# Altium schematic sheet power_supply.SchDoc
size A3
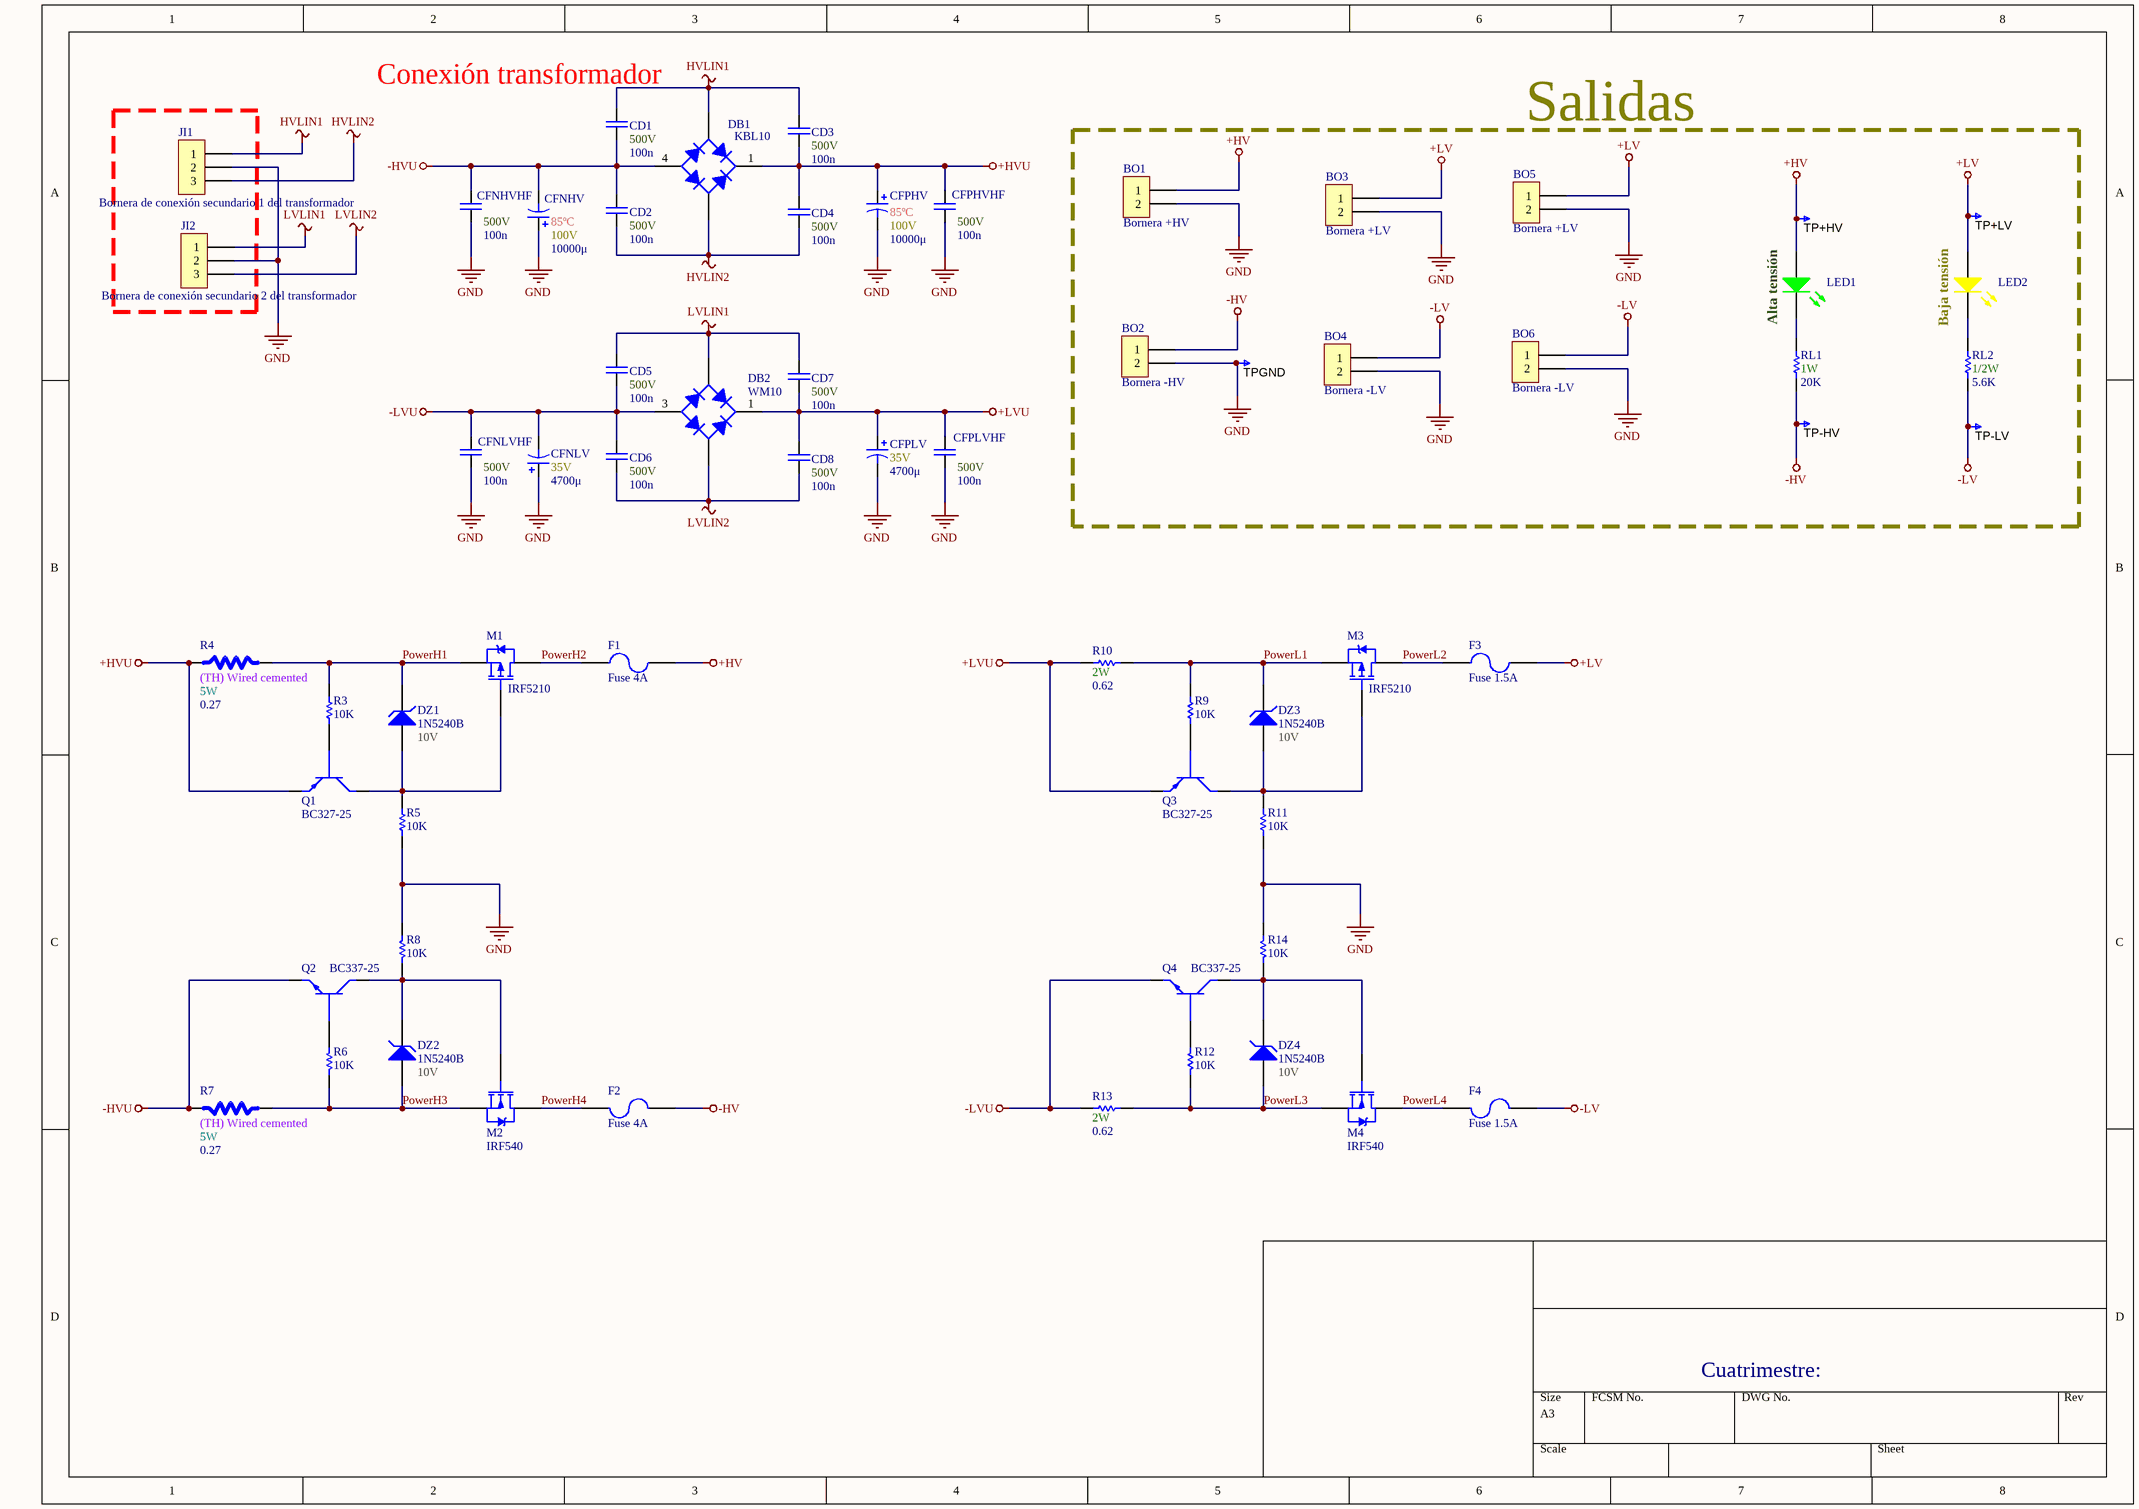
[diagram p0: power_supply.SchDoc]

## Parts
BO1  Bornera +HV  [TE-C-282822-2-C-PLUGGED]
BO2  Bornera -HV  [TE-C-282822-2-C-PLUGGED]
BO3  Bornera +LV  [TE-C-282822-2-C-PLUGGED]
BO4  Bornera -LV  [TE-C-282822-2-C-PLUGGED]
BO5  Bornera +LV  [TE-C-282822-2-C-PLUGGED]
BO6  Bornera -LV  [TE-C-282822-2-C-PLUGGED]
CD1  value 100n  Voltage: 500V  [Cer. pitch 5.0mm height 5.5mm]  (hidden comment: Cer. 100n 500V 10%)
CD2  value 100n  Voltage: 500V  [Cer. pitch 5.0mm height 5.5mm]  (hidden comment: Cer. 100n 500V 10%)
CD3  value 100n  Voltage: 500V  [Cer. pitch 5.0mm height 5.5mm]  (hidden comment: Cer. 100n 500V 10%)
CD4  value 100n  Voltage: 500V  [Cer. pitch 5.0mm height 5.5mm]  (hidden comment: Cer. 100n 500V 10%)
CD5  value 100n  Voltage: 500V  [Cer. pitch 5.0mm height 5.5mm]  (hidden comment: Cer. 100n 500V 10%)
CD6  value 100n  Voltage: 500V  [Cer. pitch 5.0mm height 5.5mm]  (hidden comment: Cer. 100n 500V 10%)
CD7  value 100n  Voltage: 500V  [Cer. pitch 5.0mm height 5.5mm]  (hidden comment: Cer. 100n 500V 10%)
CD8  value 100n  Voltage: 500V  [Cer. pitch 5.0mm height 5.5mm]  (hidden comment: Cer. 100n 500V 10%)
CFNHV  value 10000μ  Temperature: 85ºC  Voltage: 100V  [Al. Electrolytic 35.0mmx50.0mmx10mm-CLEAN]  (hidden comment: Al. Elect. 10000u 100V 20% 85º)
CFNHVHF  value 100n  Voltage: 500V  [Cer. pitch 5.0mm height 5.5mm]  (hidden comment: Cer. 100n 500V 10%)
CFNLV  value 4700μ  Voltage: 35V  [Al. Electrolytic 18.0mmx36.0mmx7.5mm]  (hidden comment: Al. Elect. 4700u 35V 20%)
CFNLVHF  value 100n  Voltage: 500V  [Cer. pitch 5.0mm height 5.5mm]  (hidden comment: Cer. 100n 500V 10%)
CFPHV  value 10000μ  Temperature: 85ºC  Voltage: 100V  [Al. Electrolytic 35.0mmx50.0mmx10mm-CLEAN]  (hidden comment: Al. Elect. 10000u 100V 20% 85º)
CFPHVHF  value 100n  Voltage: 500V  [Cer. pitch 5.0mm height 5.5mm]  (hidden comment: Cer. 100n 500V 10%)
CFPLV  value 4700μ  Voltage: 35V  [Al. Electrolytic 18.0mmx36.0mmx7.5mm]  (hidden comment: Al. Elect. 4700u 35V 20%)
CFPLVHF  value 100n  Voltage: 500V  [Cer. pitch 5.0mm height 5.5mm]  (hidden comment: Cer. 100n 500V 10%)
DB1  KBL10  [KBL]
DB2  WM10  [WOM-4]
DZ1  1N5240B  ZV: 10V  [DO-35-0.3mil]
DZ2  1N5240B  ZV: 10V  [DO-35-0.3mil]
DZ3  1N5240B  ZV: 10V  [DO-35-0.3mil]
DZ4  1N5240B  ZV: 10V  [DO-35-0.3mil]
F1  Fuse 4A  [DINKLE FUSE HOLDER 5X20]
F2  Fuse 4A  [DINKLE FUSE HOLDER 5X20]
F3  Fuse 1.5A  [DINKLE FUSE HOLDER 5X20]
F4  Fuse 1.5A  [DINKLE FUSE HOLDER 5X20]
JI1  Bornera de conexión secundario 1 del transformador  [TE-C-282822-3-C-PLUGGED]
JI2  Bornera de conexión secundario 2 del transformador  [TE-C-282822-3-C-PLUGGED]
LED1  Alta tensión  [LED_5MM_GREEN]
LED2  Baja tensión  [LED_5MM_YELLOW]
M1  IRF5210  [TO-220-FULL]
M2  IRF540  [TO-220-FULL]
M3  IRF5210  [TO-220-FULL]
M4  IRF540  [TO-220-FULL]
Q1  BC327-25  [TO-92-1]
Q2  BC337-25  [TO-92-1]
Q3  BC327-25  [TO-92-1]
Q4  BC337-25  [TO-92-1]
R3  value 10K  [AXIAL-0.4-E24-0_25W-10k]  (hidden comment: Resistor 10K 1/4W 5%)
R4  value 0.27  Type: (TH) Wired cemented  Power: 5W  [Cemented resistor 0.27 5W 5%]  (hidden comment: Cemented resistor 0.27 5W 5%)
R5  value 10K  [AXIAL-0.4-E24-0_25W-10k]  (hidden comment: Resistor 10K 1/4W 5%)
R6  value 10K  [AXIAL-0.4-E24-0_25W-10k]  (hidden comment: Resistor 10K 1/4W 5%)
R7  value 0.27  Type: (TH) Wired cemented  Power: 5W  [Cemented resistor 0.27 5W 5%]  (hidden comment: Cemented resistor 0.27 5W 5%)
R8  value 10K  [AXIAL-0.4-E24-0_25W-10k]  (hidden comment: Resistor 10K 1/4W 5%)
R9  value 10K  [AXIAL-0.4-E24-0_25W-10k]  (hidden comment: Resistor 10K 1/4W 5%)
R10  value 0.62  Power: 2W  [AXIAL-0.6-E24-2W-0.62]  (hidden comment: Resistor 0.62 2W 5%)
R11  value 10K  [AXIAL-0.4-E24-0_25W-10k]  (hidden comment: Resistor 10K 1/4W 5%)
R12  value 10K  [AXIAL-0.4-E24-0_25W-10k]  (hidden comment: Resistor 10K 1/4W 5%)
R13  value 0.62  Power: 2W  [AXIAL-0.6-E24-2W-0.62]  (hidden comment: Resistor 0.62 2W 5%)
R14  value 10K  [AXIAL-0.4-E24-0_25W-10k]  (hidden comment: Resistor 10K 1/4W 5%)
RL1  value 20K  Power: 1W  [AXIAL-0.6-E24-1W-20K]  (hidden comment: Resistor 20K 1W 5%)
RL2  value 5.6K  Power: 1/2W  [AXIAL-0.5-E24-0_5W-5.6K]  (hidden comment: Resistor 5.6K 1/2W 5%)
TP+HV  TESTPOINT_THT  [TP-THT-MULTI]  (value not drawn)
TP+LV  TESTPOINT_THT  [TP-THT-MULTI]  (value not drawn)
TP-HV  TESTPOINT_THT  [TP-THT-MULTI]  (value not drawn)
TP-LV  TESTPOINT_THT  [TP-THT-MULTI]  (value not drawn)
TPGND  TESTPOINT_THT  [TP-THT-MULTI]  (value not drawn)

## Blocks framed on the sheet
Salidas: BO1-BO6 LED1 LED2 RL1 RL2 TP+HV TP+LV TP-HV TP-LV TPGND

## Nets
+HV: BO1.1 F1.1 LED1.A TP+HV.1
+HVU: CD3.1 CD4.2 CFPHV.1 CFPHVHF.2 DB1.1(V+) Q1.3(E) R4.1
+LV: BO3.1 BO5.1 F3.1 LED2.A TP+LV.1
+LVU: CD7.1 CD8.2 CFPLV.1 CFPLVHF.2 DB2.1(V+) Q3.3(E) R10.1
-HV: BO2.1 F2.1 RL1.1 TP-HV.1
-HVU: CD1.1 CD2.2 CFNHV.2 CFNHVHF.2 DB1.4(V-) Q2.3(E) R7.1
-LV: BO4.1 BO6.1 F4.1 RL2.1 TP-LV.1
-LVU: CD5.1 CD6.2 CFNLV.2 CFNLVHF.2 DB2.3(V-) Q4.3(E) R13.1
GND: BO1.2 BO2.2 BO3.2 BO4.2 BO5.2 BO6.2 CFNHV.1 CFNHVHF.1 CFNLV.1 CFNLVHF.1 CFPHV.2 CFPHVHF.1 CFPLV.2 CFPLVHF.1 JI1.2 JI2.2 R5.1 R8.1 R11.1 R14.1 TPGND.1
HVLIN1: CD1.2 CD3.2 DB1.2(AC1) JI1.1
HVLIN2: CD2.1 CD4.1 DB1.3(AC2) JI1.3
LVLIN1: CD5.2 CD7.2 DB2.4(AC2) JI2.1
LVLIN2: CD6.1 CD8.1 DB2.2(AC1) JI2.3
PowerH1: DZ1.2(K) M1.3(S) R3.2 R4.2
PowerH2: F1.2 M1.2(D)
PowerH3: DZ2.1(A) M2.3(S) R6.2 R7.2
PowerH4: F2.2 M2.2(D)
PowerL1: DZ3.2(K) M3.3(S) R9.2 R10.2
PowerL2: F3.2 M3.2(D)
PowerL3: DZ4.1(A) M4.3(S) R12.2 R13.2
PowerL4: F4.2 M4.2(D)
NetDZ1_1: DZ1.1(A) M1.1(G) Q1.1(C) R5.2
NetDZ2_2: DZ2.2(K) M2.1(G) Q2.1(C) R8.2
NetDZ3_1: DZ3.1(A) M3.1(G) Q3.1(C) R11.2
NetDZ4_2: DZ4.2(K) M4.1(G) Q4.1(C) R14.2
NetLED1_K: LED1.K RL1.2
NetLED2_K: LED2.K RL2.2
NetQ1_2: Q1.2(B) R3.1
NetQ2_2: Q2.2(B) R6.1
NetQ3_2: Q3.2(B) R9.1
NetQ4_2: Q4.2(B) R12.1

## Notes on the sheet
- Conexión transformador
- Cuatrimestre:

## Library data of the parts
BO1-BO6 = C-282822-2-C: TERMI-BLOK HEADER,ASSY90 2P - serie 282822 - 5.00mm; Manufacturer: TE Connectivity; ComponentLink1 Description: Manufacturer; ComponentLink2 Description: Datasheet; NoPins: 02; Created Date: 6 MArch 2017; partNo: C-282822-2-C; ComponentLink1URL: http://www.te.com/usa-en/home.html; ComponentLink2URL: http://www.te.com/usa-en/product-282822-2.html
CD1-CD8 CFNHVHF CFNLVHF CFPHVHF CFPLVHF = Cer. 100n 500V 10%: Ceramic Capacitor 100nF 500V 10%; Application: Medium and high voltage type range from 160V-450V used as primary side input filter in power supply, which can be used in general switching power supply, PC power supply and industrial computer power supply,server power supply, AC-DC converter, motor drive circuit DC storage filter, digital audio, digital TV, communication base station, DC-AC inverter, inverter power supply and converters etc; Characteristics: Ceramic Capacitor; Tolerance: 10%; Supplier: *; Price: *; Power: *
CFNHV CFPHV = Al. Elect. 10000u 100V 20% 85º: Aluminum Electrolytic Capacitor 10000μF 100V 20% 85º; Application: Medium and high voltage type range from 160V-450V used as primary side input filter in power supply, which can be used in general switching power supply, PC power supply and industrial computer power supply,server power supply, AC-DC converter, motor drive circuit DC storage filter, digital audio, digital TV, communication base station, DC-AC inverter, inverter power supply and converters etc; Characteristics: Aluminum Electrolytic Capacitor; Tolerance: 20%; Price: *; Supplier: *; Power: *
CFNLV CFPLV = Al. Elect. 4700u 35V 20%: Aluminum Electrolytic Capacitor 4700μF 35V 20%; Application: Medium and high voltage type range from 160V-450V used as primary side input filter in power supply, which can be used in general switching power supply, PC power supply and industrial computer power supply,server power supply, AC-DC converter, motor drive circuit DC storage filter, digital audio, digital TV, communication base station, DC-AC inverter, inverter power supply and converters etc; Characteristics: Aluminum Electrolytic Capacitor; Tolerance: 20%; Supplier: *; Price: *; Power: *; Temperature: *
DB1 = KBL10: Single phase silicon bridge rectifier 1000V 4A; Voltage: 1000V; Current: 4A; Power: *; Price: *; Supplier: *; Value: *
DB2 = WM10: Single phase silicon bridge rectifier 1000V 1.5A; Voltage: 1000V; Current: 1.5A; Supplier: *; Value: *; Power: *; Price: *
DZ1-DZ4 = 1N5240B: Zener Diode, 10V, 500mW; Manufacturer: Microsemi; IZT: 20mA; Published: 8-Jun-2000; LatestRevisionDate: 17-Jul-2002; LatestRevisionNote: Re-released for DXP Platform.; DatasheetDocument: 1997; PackageReference: DO-35; Publisher: Altium Limited; Code_JEDEC: DO-204-AH; ComponentLink2Description: Datasheet; ComponentLink2URL: https://www.microsemi.com/document-portal/doc_download/5906-1n746-759a-4370-4372a-datasheet; PartNumber: 1N5240B; Power: 500mW; Supplier: *; Price: *; ComponentLink3Description: Microsemi product information; ComponentLink3URL: https://www.microsemi.com/existing-parts/parts/121290#resources
F1-F4 = Fuse Holder: Fuse; PackageDescription: Thru-Hole; 2 Leads; Supplier: *; Price: *; Power: *; Value: *
JI1 JI2 = C-282822-3-C: TERMI-BLOK HEADER,ASSY90 3P - serie 282822 - 5.00mm; Manufacturer: TE Connectivity; ComponentLink1 Description: Manufacturer; ComponentLink2 Description: Datasheet; NoPins: 03; Created Date: 6 MArch 2017; partNo: C-282822-3-C; ComponentLink1URL: http://www.te.com/usa-en/home.html; ComponentLink2URL: http://www.te.com/usa-en/product-282822-3.html
LED1 = LED (GREEN): Typical LED (GREEN); Publisher: Altium Limited
LED2 = LED (YELLOW): Typical LED (YELLOW); Publisher: Altium Limited
M1 M3 = IRF5210: P-CHANNEL Power MOSFET 100V - 40A -  0.06Ω; Vendor: Infineon; Supersection: Semiconductors; Section: Discretes; C: Copyright (C) 2015 Accelerated Designs. All rights reserved; Power: 200W; Manufacturer_Part_Number: IRF5210; Family: MOSFET; Manufacturer_Name: Infineon; Copyright: Copyright (C) 2015 Accelerated Designs. All rights reserved; Value: Value; Supplier: *; Price: *
M2 M4 = IRF540: N-CHANNEL Power MOSFET 100V - 20A -  0.077Ω; Vendor: Vishay; Supersection: Semiconductors; Section: Discretes; C: Copyright (C) 2015 Accelerated Designs. All rights reserved; Power: 150; Manufacturer_Part_Number: IRF540; Family: MOSFET; Manufacturer_Name: Vishay; Copyright: Copyright (C) 2015 Accelerated Designs. All rights reserved; Value: Value; Supplier: *; Price: *
Q1 Q3 = BC327-25: PNP Bipolar Transistor; Manufacturer: ON Semiconductor; PartNumber: MJE340G; VCEO: 300V; IC: 500mA; Power: 20W; ComponentLink1Description: ON semiconductor product information; ComponentLink1URL: https://www.onsemi.com/PowerSolutions/product.do?id=BC327-25; ComponentLink2Description: Datasheet; ComponentLink2URL: https://www.onsemi.com/pub/Collateral/BC327-D.PDF; Price: *; Supplier: *; VCB: 300V
Q2 Q4 = BC337-25: NPN Bipolar Transistor; Manufacturer: ON Semiconductor; PartNumber: MJE340G; VCEO: 300V; IC: 500mA; Power: 20W; ComponentLink1Description: ON semiconductor product information; ComponentLink1URL: https://www.onsemi.com/PowerSolutions/product.do?id=BC337-25; ComponentLink2Description: Datasheet; ComponentLink2URL: https://www.onsemi.com/pub/Collateral/BC337-D.PDF; Price: *; Supplier: *; VCB: 300V
R3 R5 R6 R8 R9 R11 R12 R14 = Resistor 10K 1/4W 5%: Resistor 10KΩ 1/4W 5%; Power: 1/4W; Tolerance: 5%; Price: *; Supplier: *; Type: (TH) Metal film
R4 R7 = Cemented resistor 0.27 5W 5%: Cemented resistor 0.27Ω 5% 5W; Tolerance: 5%; Supplier: *; Price: *
R10 R13 = Resistor 0.62 2W 5%: Resistor 0.62Ω 2W 5%; Tolerance: 5%; Price: *; Supplier: *; Type: (TH) Carbon film
RL1 = Resistor 20K 1W 5%: Resistor 20KΩ 1W 5%; Tolerance: 5%; Price: *; Supplier: *; Type: (TH) Carbon film
RL2 = Resistor 5.6K 1/2W 5%: Resistor 5.6KΩ 1/2W 5%; Tolerance: 5%; Price: *; Type: (TH) Metal film; Supplier: *
TP+HV TP+LV TP-HV TP-LV TPGND = TESTPOINT_THT: Test Point PCB mount Multi-purpose Black; Manufacturer 1: Keystone Electronics; Manufacturer Part Number 1: 5014; PBL Part Number: 3100-xxx; Description 1: TEST POINT PC MULTI PURPOSE YEL; Supplier 1: Digi-Key; Supplier Part Number 1: 5014K-ND; Mounting Type: 0.063" (1.600mm) Hole Diameter; Material: Base, Nylon 46, UL 94V-0